# Altium schematic sheet contactor_control.SchDoc: foxBMS BMS-Master
size A3; DocumentNumber: 16; SheetNumber: 16; SheetTotal: 24; Author: Fraunhofer IISB foxBMS Team; REL-DATE: 2017-05-16; VERSION: 1.0.2; SheetDescription: Contactor Control
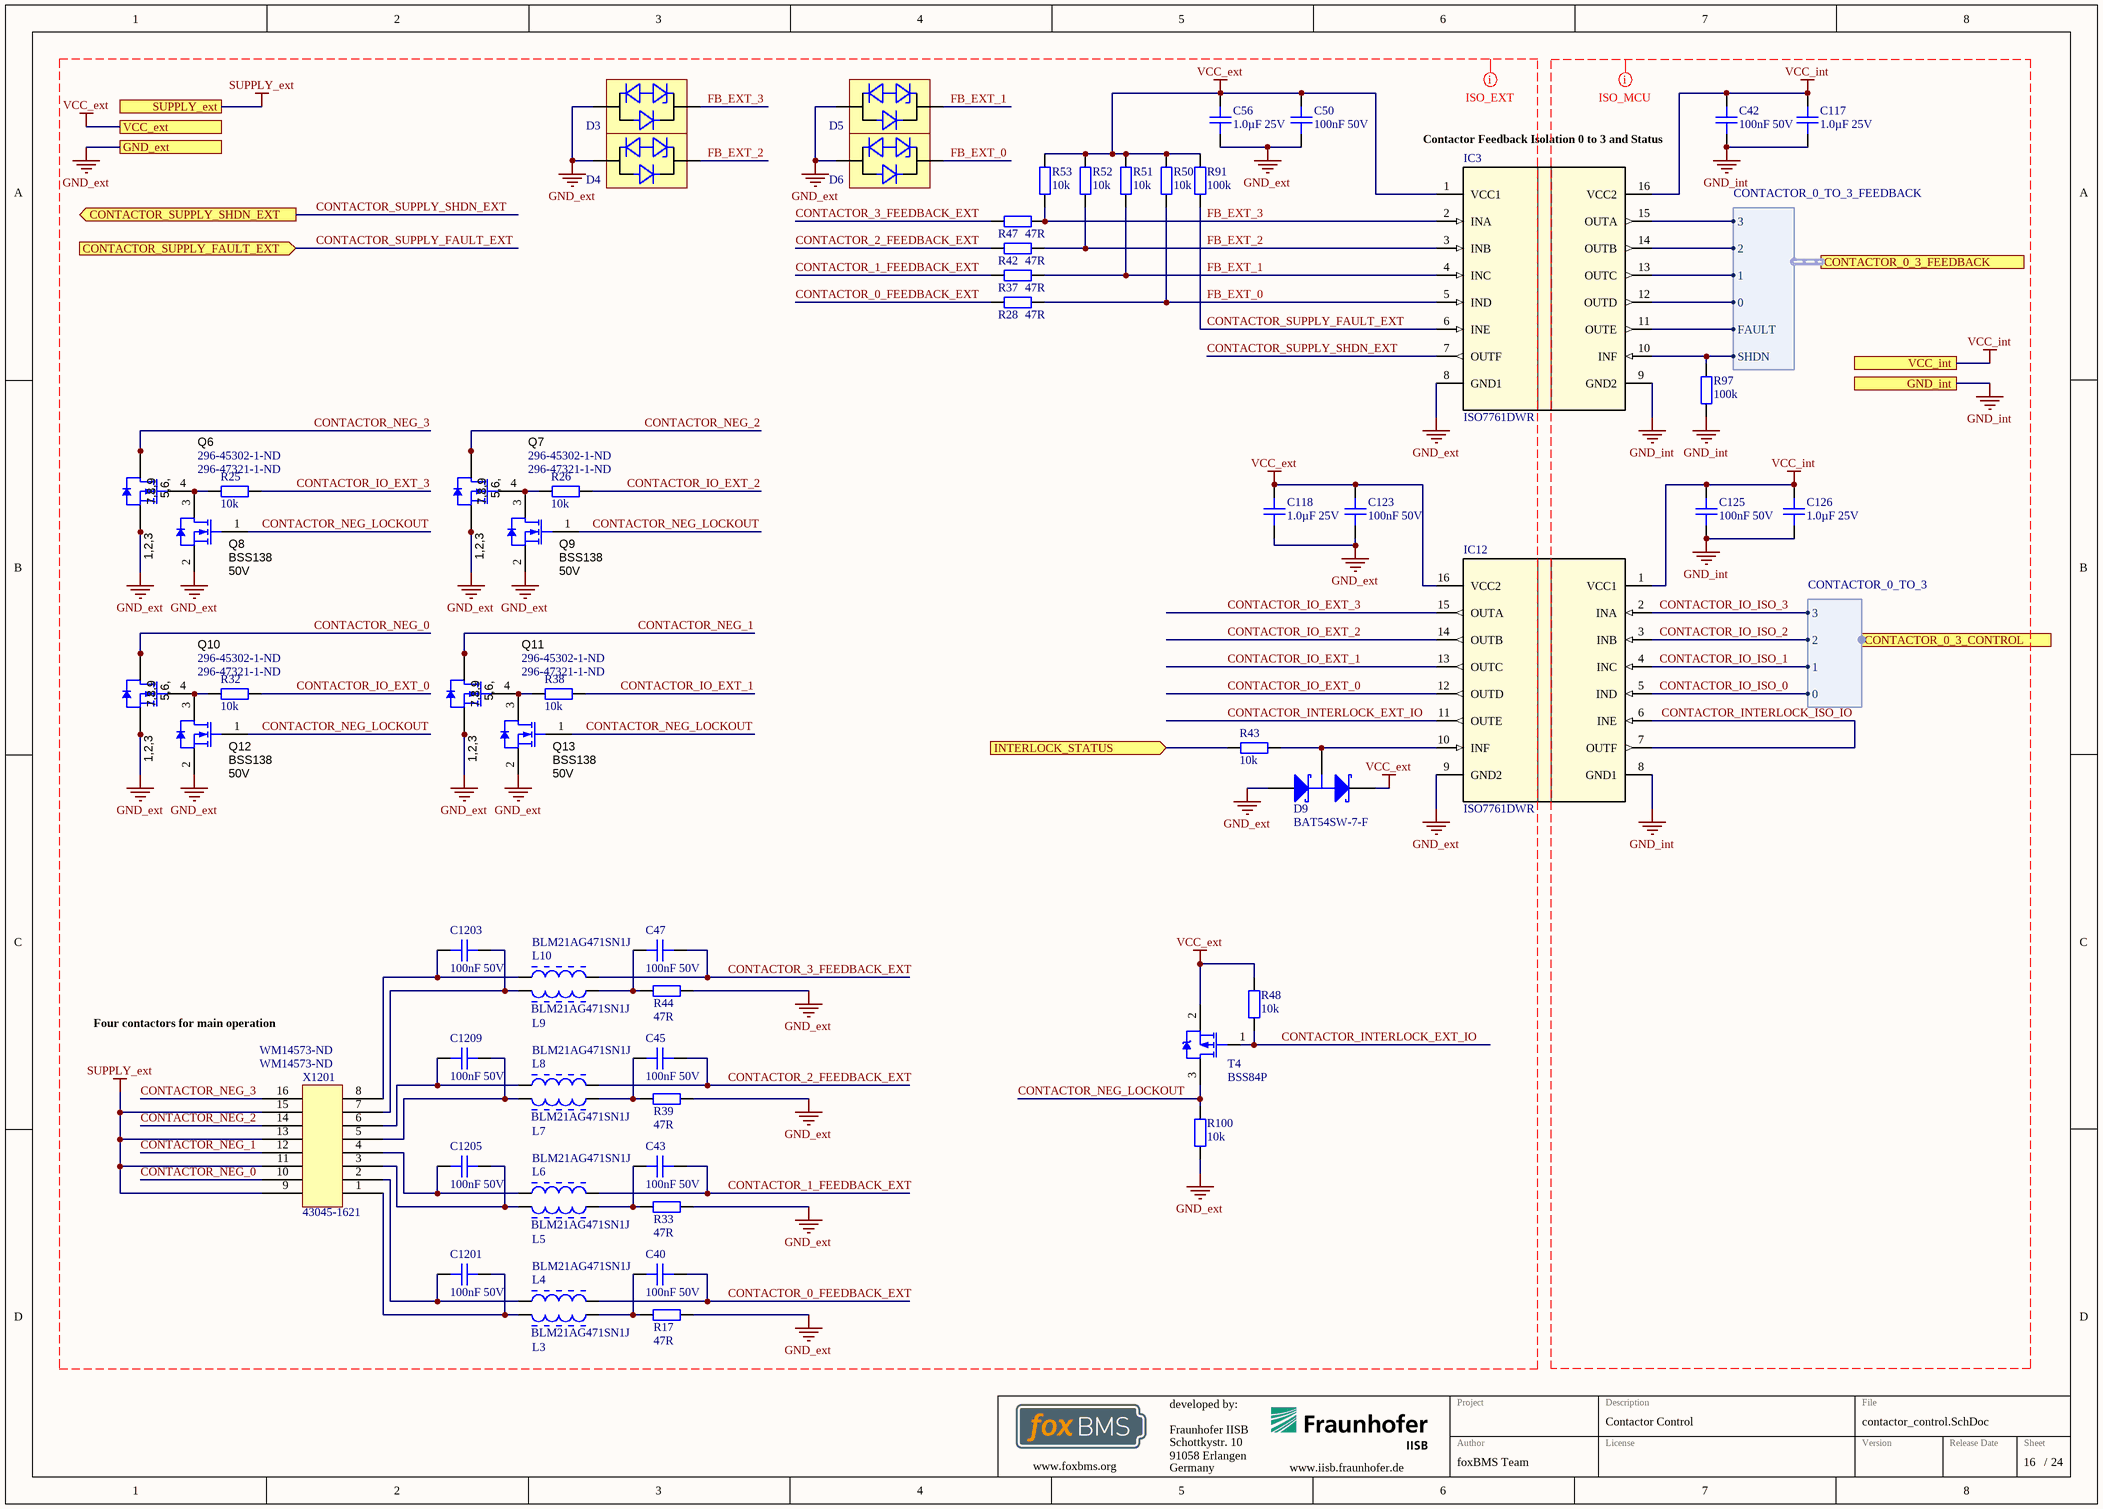
[diagram p0: contactor_control.SchDoc]

## Parts
C40  100nF 50V  [0603C]
C42  100nF 50V  [0603C]
C43  100nF 50V  [0603C]
C45  100nF 50V  [0603C]
C47  100nF 50V  [0603C]
C50  100nF 50V  [0603C]
C56  1.0µF 25V  [0603C]
C117  1.0µF 25V  [0603C]
C118  1.0µF 25V  [0603C]
C123  100nF 50V  [0603C]
C125  100nF 50V  [0603C]
C126  1.0µF 25V  [0603C]
C1201  100nF 50V  [0603C]
C1203  100nF 50V  [0603C]
C1205  100nF 50V  [0603C]
C1209  100nF 50V  [0603C]
D3  CDSOD323-T05  [SODFL250X110-2N]  (value not drawn)
D4  CDSOD323-T05  [SODFL250X110-2N]  (value not drawn)
D5  CDSOD323-T05  [SODFL250X110-2N]  (value not drawn)
D6  CDSOD323-T05  [SODFL250X110-2N]  (value not drawn)
D9  BAT54SW-7-F  [DIOD-SOT323-3_V]
IC3  ISO7761DWR  [DW0016B_N]
IC12  ISO7761DWR  [DW0016B_N]
L3  BLM21AG471SN1J  [MURA-BLM21-H1-CHIP-2_V]
L4  BLM21AG471SN1J  [MURA-BLM21-H1-CHIP-2_V]
L5  BLM21AG471SN1J  [MURA-BLM21-H1-CHIP-2_V]
L6  BLM21AG471SN1J  [MURA-BLM21-H1-CHIP-2_V]
L7  BLM21AG471SN1J  [MURA-BLM21-H1-CHIP-2_V]
L8  BLM21AG471SN1J  [MURA-BLM21-H1-CHIP-2_V]
L9  BLM21AG471SN1J  [MURA-BLM21-H1-CHIP-2_V]
L10  BLM21AG471SN1J  [MURA-BLM21-H1-CHIP-2_V]
Q6  Supplier Part Number 1: 296-45302-1-ND  Supplier Part Number 2: 296-47321-1-ND  [SONQ3A]  (hidden comment: CSD18543Q3A)
Q7  Supplier Part Number 1: 296-45302-1-ND  Supplier Part Number 2: 296-47321-1-ND  [SONQ3A]  (hidden comment: CSD18543Q3A)
Q8  BSS138  value 50V  [SOT-23]
Q9  BSS138  value 50V  [SOT-23]
Q10  Supplier Part Number 1: 296-45302-1-ND  Supplier Part Number 2: 296-47321-1-ND  [SONQ3A]  (hidden comment: CSD18543Q3A)
Q11  Supplier Part Number 1: 296-45302-1-ND  Supplier Part Number 2: 296-47321-1-ND  [SONQ3A]  (hidden comment: CSD18543Q3A)
Q12  BSS138  value 50V  [SOT-23]
Q13  BSS138  value 50V  [SOT-23]
R17  47R  [0603R]
R25  10k  [0603R]
R26  10k  [0603R]
R28  47R  [0603R]
R32  10k  [0603R]
R33  47R  [0603R]
R37  47R  [0603R]
R38  10k  [0603R]
R39  47R  [0603R]
R42  47R  [0603R]
R43  10k  [0603R]
R44  47R  [0603R]
R47  47R  [0603R]
R48  10k  [0603R]
R50  10k  [0603R]
R51  10k  [0603R]
R52  10k  [0603R]
R53  10k  [0603R]
R91  100k  [0603R]
R97  100k  [0603R]
R100  10k  [0603R]
T4  BSS84P  [INF-PG-SOT23_N]
X1201  43045-1621  Supplier Part Number 1: WM14573-ND  [43045-1621]

## Ports
CONTACTOR_0_3_CONTROL (harness CONTACTOR_0_TO_3), CONTACTOR_0_3_FEEDBACK (harness CONTACTOR_0_TO_3_FEEDBACK), CONTACTOR_SUPPLY_FAULT_EXT (in), CONTACTOR_SUPPLY_SHDN_EXT (out), GND_ext, GND_int, INTERLOCK_STATUS (in), SUPPLY_ext, VCC_ext, VCC_int

## Harnesses
CONTACTOR_0_TO_3: 0, 1, 2, 3
CONTACTOR_0_TO_3_FEEDBACK: 0, 1, 2, 3, FAULT, SHDN

## Nets
GND_ext: C50.2 C56.2 C118.2 C123.2 D3.2(A) D4.2(A) D5.2(A) D6.2(A) D9.1(A) IC3.8(GND1) IC12.9(GND2) Q6.1(S) Q6.2(S) Q6.3(S) Q7.1(S) Q7.2(S) Q7.3(S) Q8.2(S) Q9.2(S) Q10.1(S) Q10.2(S) Q10.3(S) Q11.1(S) Q11.2(S) Q11.3(S) Q12.2(S) Q13.2(S) R17.2 R33.2 R39.2 R44.2 R100.1 ; port GND_ext
GND_int: C42.2 C117.2 C125.2 C126.2 IC3.9(GND2) IC12.8(GND1) R97.1 ; port GND_int
SUPPLY_ext: X1201.9 X1201.11 X1201.13 X1201.15 ; port SUPPLY_ext
VCC_ext: C50.1 C56.1 C118.1 C123.1 D9.2(K) IC3.1(VCC1) IC12.16(VCC2) R48.2 R50.2 R51.2 R52.2 R53.2 R91.2 T4.2(SOURCE) ; port VCC_ext
VCC_int: C42.1 C117.1 C125.1 C126.1 IC3.16(VCC2) IC12.1(VCC1) ; port VCC_int
CONTACTOR_0_FEEDBACK_EXT: C40.2 L4.2 R28.1
CONTACTOR_1_FEEDBACK_EXT: C43.2 L6.2 R37.1
CONTACTOR_2_FEEDBACK_EXT: C45.2 L8.2 R42.1
CONTACTOR_3_FEEDBACK_EXT: C47.2 L10.2 R47.2
CONTACTOR_INTERLOCK_EXT_IO: IC12.11(OUTE) R48.1 T4.1(GATE)
CONTACTOR_INTERLOCK_ISO_IO: IC12.6(INE) IC12.7(OUTF)
CONTACTOR_IO_EXT_0: IC12.12(OUTD) R32.1
CONTACTOR_IO_EXT_1: IC12.13(OUTC) R38.1
CONTACTOR_IO_EXT_2: IC12.14(OUTB) R26.1
CONTACTOR_IO_EXT_3: IC12.15(OUTA) R25.1
CONTACTOR_IO_ISO_0: IC12.5(IND) ; port CONTACTOR_0_3_CONTROL.0
CONTACTOR_IO_ISO_1: IC12.4(INC) ; port CONTACTOR_0_3_CONTROL.1
CONTACTOR_IO_ISO_2: IC12.3(INB) ; port CONTACTOR_0_3_CONTROL.2
CONTACTOR_IO_ISO_3: IC12.2(INA) ; port CONTACTOR_0_3_CONTROL.3
CONTACTOR_NEG_0: Q10.5(D) Q10.6(D) Q10.7(D) Q10.8(D) Q10.9(D) X1201.10
CONTACTOR_NEG_1: Q11.5(D) Q11.6(D) Q11.7(D) Q11.8(D) Q11.9(D) X1201.12
CONTACTOR_NEG_2: Q7.5(D) Q7.6(D) Q7.7(D) Q7.8(D) Q7.9(D) X1201.14
CONTACTOR_NEG_3: Q6.5(D) Q6.6(D) Q6.7(D) Q6.8(D) Q6.9(D) X1201.16
CONTACTOR_NEG_LOCKOUT: Q8.1(G) Q9.1(G) Q12.1(G) Q13.1(G) R100.2 T4.3(DRAIN)
CONTACTOR_SUPPLY_FAULT_EXT: IC3.6(INE) R91.1 ; port CONTACTOR_SUPPLY_FAULT_EXT
CONTACTOR_SUPPLY_SHDN_EXT: IC3.7(OUTF) ; port CONTACTOR_SUPPLY_SHDN_EXT
FB_EXT_0: D6.1(K) IC3.5(IND) R28.2 R50.1
FB_EXT_1: D5.1(K) IC3.4(INC) R37.2 R51.1
FB_EXT_2: D4.1(K) IC3.3(INB) R42.2 R52.1
FB_EXT_3: D3.1(K) IC3.2(INA) R47.1 R53.1
INTERLOCK_STATUS: R43.2 ; port INTERLOCK_STATUS
NetC40_1: C40.1 L3.2 R17.1
NetC43_1: C43.1 L5.2 R33.1
NetC45_1: C45.1 L7.2 R39.1
NetC47_1: C47.1 L9.2 R44.1
NetC1201_1: C1201.1 L4.1 X1201.2
NetC1201_2: C1201.2 L3.1 X1201.1
NetC1203_1: C1203.1 L10.1 X1201.8
NetC1203_2: C1203.2 L9.1 X1201.7
NetC1205_1: C1205.1 L6.1 X1201.4
NetC1205_2: C1205.2 L5.1 X1201.3
NetC1209_1: C1209.1 L8.1 X1201.6
NetC1209_2: C1209.2 L7.1 X1201.5
NetD9_3: D9.3(C) IC12.10(INF) R43.1
NetIC3_10: IC3.10(INF) R97.2 ; port CONTACTOR_0_3_FEEDBACK.SHDN
NetIC3_11: IC3.11(OUTE) ; port CONTACTOR_0_3_FEEDBACK.FAULT
NetIC3_12: IC3.12(OUTD) ; port CONTACTOR_0_3_FEEDBACK.0
NetIC3_13: IC3.13(OUTC) ; port CONTACTOR_0_3_FEEDBACK.1
NetIC3_14: IC3.14(OUTB) ; port CONTACTOR_0_3_FEEDBACK.2
NetIC3_15: IC3.15(OUTA) ; port CONTACTOR_0_3_FEEDBACK.3
NetQ6_4: Q6.4(G) Q8.3(D) R25.2
NetQ7_4: Q7.4(G) Q9.3(D) R26.2
NetQ10_4: Q10.4(G) Q12.3(D) R32.2
NetQ11_4: Q11.4(G) Q13.3(D) R38.2

## Layout directives
net class ISO_MCU: CONTACTOR_INTERLOCK_ISO_IO, CONTACTOR_IO_ISO_0, CONTACTOR_IO_ISO_1, CONTACTOR_IO_ISO_2, CONTACTOR_IO_ISO_3, GND_int, VCC_int
net class ISO_EXT: CONTACTOR_0_FEEDBACK_EXT, CONTACTOR_1_FEEDBACK_EXT, CONTACTOR_2_FEEDBACK_EXT, CONTACTOR_3_FEEDBACK_EXT, CONTACTOR_INTERLOCK_EXT_IO, CONTACTOR_IO_EXT_0, CONTACTOR_IO_EXT_1, CONTACTOR_IO_EXT_2, CONTACTOR_IO_EXT_3, CONTACTOR_NEG_0, CONTACTOR_NEG_1, CONTACTOR_NEG_2, CONTACTOR_NEG_3, CONTACTOR_NEG_LOCKOUT, CONTACTOR_SUPPLY_FAULT_EXT, CONTACTOR_SUPPLY_SHDN_EXT, FB_EXT_0, FB_EXT_1, FB_EXT_2, FB_EXT_3, GND_ext, SUPPLY_ext, VCC_ext

## Notes on the sheet
- (near C42) Contactor Feedback Isolation 0 to 3 and Status
- Four contactors for main operation
- Fraunhofer IISB
- Schottkystr. 10
- developed by:
- 91058 Erlangen
- Germany
- Author
- Project
- License
- Description
- File
- Version
- Release Date
- Sheet
- www.foxbms.org
- www.iisb.fraunhofer.de
- foxBMS Team
- /
- (in symbol CSD18543Q3A) 7,8,9; 5,6,; 1,2,3

## Library data of the parts
C40 C42 C43 C45 C47 C50 C123 C125 C1201 C1203 C1205 C1209 = gen_C_ceramic_100n_50V_X7R_0603: Ceramic, 100nF, ±10%, 50V, X7R, –55 to 125°C, 0603 (1608),RoHS, Automotive; Part Number: GCJ188R71H104KA12; Manufacturer: Murata; Capacitance: 100n; Case EIA: 0603; Case Metric: 1608; PnP Package: C_0603_10; PnP Value: 100nF/50V/X7R; PnP equipped: x; Automotive Qualified: True; Rated Voltage: 50V; Dielectric: X7R; Supplier 1: Digi-Key; Supplier Part Number 1: 490-5798-1-ND; Height - Seated (Max): 0.8mm; Mounting Type: SurfaceMount,MLCC; Operating Temperature: –55 to 125°C; Series: GCJ; Tolerance: ±10%; Manufacturer_Part_Number: GCJ188R71H104KA12
C56 C117 C118 C126 = gen_C_ceramic_1u_25V_X7R_0603: Ceramic, 1.0µF, ±10%, 25V, X7R, –55 to 125°C, 0603 (1608),RoHS, Automotive; Part Number: GCJ188R71E105KA01; Manufacturer: Murata; Capacitance: 1µF; Case EIA: 0603; Case Metric: 1608; PnP Package: C_0603_10; PnP Value: 1.0µF/25V/X7R; Automotive Qualified: True; Rated Voltage: 25V; Dielectric: X7R; Supplier 1: Digi-Key; Supplier Part Number 1: 490-14409-1-ND; Height - Seated (Max): 0.8mm; Mounting Type: SurfaceMount,MLCC; Operating Temperature: –55 to 125°C; Series: GCJ; Tolerance: ±10%; Manufacturer_Part_Number: GCJ188R71E105KA01
D3-D6 = CDSOD323-T05: TVS Diode, CDSOD323 Series, Unidirectional, 5 V, 18.3 V, SOD-323, 2 Pins; Manufacturer: Bourns; Breakdown Voltage: 6V; Automotive Qualified: False; Part Number: CDSOD323-T05; Part Name: CDSOD323-T05; Operating Temperature: -55°C - +150°C; ComponentLink1Description: Datasheet; ComponentLink1URL: http://www.farnell.com/datasheets/1845299.pdf; Supplier 1: Farnell; Supplier Part Number 1: 2341914
D9 = CMP-2000-05929-1: Schottky Barrier Diode, 30 V, 200 mA, -65 to 125 degC, 3-Pin SOT323, RoHS, Tape and Reel; Unit Weight: 0.000212oz; Ifsm - Forward Surge Current: 0.6A; Vf - Forward Voltage: 1Vat0.1A; Brand: DiodesIncorporated; Pd - Power Dissipation: 200mW; Ir - Reverse Current: 2uAat25V; Type: SurfaceMountSchottkyBarrierDiodeArray; Vrrm - Repetitive Reverse Voltage: 30V; If - Forward Current: 0.2A; trr - Reverse Recovery time: 5ns; Configuration: DualSeries; Minimum Operating Temperature: -65C; Mounting Style: SMD/SMT; Manufacturer URL: http://www.diodes.com/; Mounting Technology: SurfaceMount; Packaging: Reel; Length: 2.2mm; Product Category: SchottkyDiodes&Rectifiers; Datasheet Version: Rev. 15-2, 03/2014; Series: BAT54; Operating Temperature Range: -65Cto+125C; Manufacturer: DiodesIncorporated; Technology: Si; Datasheet URL: http://www.diodes.com/_files/datasheets/ds30065.pdf; Height: 1mm; Width: 1.35mm; Termination Style: SMD/SMT; Maximum Operating Temperature: +125C; Product: SchottkyDiodes; Package / Case: SOT-323; Package Reference: SOT323; RoHS: True; Package Description: 3-Pin Small Outline Transistor, Body 2 x 1.25 mm, Pitch 0.65 mm; Factory Pack Quantity: 3000
IC3 IC12 = ISO7761DWR: Imported; Manufacturer: Texas Instruments; PartNumber: ISO7761DWR; RefDes: RefDes; TYPE: TYPE; Value: Value
L3-L10 = C5133952-28DE-41F1-874F-4A9C3E40D898: Chip Ferrite Bead for General Signal lines, 470 Ohm, 700 mA, -55 to 125 degC, 2 x 1.25 x 1.05 mm SMD, Tape and Reel; Manufacturer: Murata; DC Resistance: 0.19 Ohm Max.; Impedance (at 100 MHz): 470 Ohm +/- 25%; Rated Current: 700 mA; ComponentLink1URL: http://www.murata.com/; Packing: Tape and Reel; PackageDescription: 2-Pin Chip, Body 2 x 1.25 mm; ComponentLink3Description: Package Specification; Operating Temperature Range: -55 to 125 degC; ComponentLink1Description: Manufacturer URL; PartNumber: BLM21AG471SN1J; DatasheetVersion: 08/2013; Mounting Technology: Surface Mount; ComponentLink2URL: http://www.murata.com/products/catalog/pdf/c31e.pdf; ComponentLink3URL: http://www.murata.com/products/catalog/pdf/c31e.pdf; ComponentLink2Description: Datasheet; PackageReference: BLM21_H1050-2; Part Number: BLM21AG471SN1J
Q6 Q7 Q10 Q11 = CSD18543Q3A: 60V, N ch NexFET MOSFET™, single SON3x3, 9.9mOhm; Manufacturer: Texas Instruments; Alternate Manufacturer: None; CompType: MOSFET; Value: 30V; U/M: EA; VdsMax_V: 60; Value1: 0.0081 ohm; Rdson45_Ohm: 0.0081; Value2: 1.7 nC; QgTyp_nC: 1.7; Vgs_V: 10; IdsMax_A: 156; SymbolVersion: 2008-07-09; PartNumber: CSD18543Q3A; PackageReference: SON 3.3x3.3mm; ChType: N; RoHS: Y; MountType: SMT; Published: 2008-06-19; Publisher: Texas Instruments; LatestRevisionDate: 2013-07-24; LatestRevisionNote: Added parts.; ComponentLink1Description: Datasheet link; ComponentLink1URL: http://www.ti.com/lit/ds/symlink/csd18543q3a.pdf; Supplier 1: Digi-Key; Supplier 2: Digi-Key
Q8 Q9 Q12 Q13 = BSS138: MOSFET, N-CH, 50V, 0.22A, SOT-23; Manufacturer: Fairchild Semiconductor; Alternate Manufacturer: None; U/M: EA; ChType: N; VdsMax_V: 50; Value1: 6 ohm; Rdson45_Ohm: 6; Value2: 1.7 nC; QgTyp_nC: 1.7; Vgs_V: 20; IdsMax_A: 0.22; ComponentLink1URL: http://www.fairchildsemi.com/ds/BS/BSS138.pdf; SymbolVersion: 2008-07-28; PackageReference: SOT-23; PartNumber: BSS138; ComponentLink1Description: Datasheet link; CompType: MOSFET; RoHS: Y; MountType: SMT; Published: 2008-06-19; Publisher: Texas Instruments; LatestRevisionDate: 2013-07-10; LatestRevisionNote: Added parts.; Supplier 1: Digi-Key; Supplier Part Number 1: BSS138CT-ND; Supplier 2: Mouser; Supplier Part Number 2: 512-BSS138; Supplier 3: Farnell; Supplier Part Number 3: 9845330
R17 R28 R33 R37 R39 R42 R44 R47 = gen_R_47R_0603: SMD Resistor 47R 0603; Tolerance: 1%; Power: 0.1W; Case EIA: 0603; Case Metric: 1608; Maximum Working Voltage: 75V; PnP Package: R_0603; Automotive Qualified: False; Part Number: gen_R_47R_0603; Operating Temperature: -55°C - +155°C; Resistance: 47R; Series: E24; PnP Value: 47R; Supplier 1: Farnell; Supplier Part Number 1: 2303030
R25 R26 R32 R38 R43 R48 R50-R53 R100 = gen_R_10k_0603: SMD Resistor 10k 0603; Tolerance: 1%; Power: 0.1W; Case EIA: 0603; Case Metric: 1608; Maximum Working Voltage: 75V; PnP Package: R_0603; Automotive Qualified: False; Part Number: gen_R_10k_0603; Operating Temperature: -55°C - +155°C; Resistance: 10k; Series: E24, E96; PnP Value: 10k; Supplier 1: Farnell; Supplier Part Number 1: 2073349
R91 R97 = gen_R_100k_0603: SMD Resistor 100k 0603; Case EIA: 0603; Case Metric: 1608; PnP Package: R_0603; Automotive Qualified: False; Operating Temperature: -55°C - +155°C; PnP Value: 100k; Part Number: gen_R_100k_0603
T4 = CMP-1099-00028-1: P-Channel SIPMOS Small-Signal-Transistor, -60 V VDS, -0.17 A ID, -55 to 150 degC, PG-SOT23, Reel, Green; Manufacturer: Infineon; VGS(th) (max): -2Â V; VGS(th) (min): -1Â V; VDS (max): -60Â V; Rth: 350Â K/W; Pto t (max): 0.36Â W; ID (max): -0.17Â A; IDpuls (max): -0.68Â A; RDS (on) (max) (@4.5V): 12,000Â mOhm; QG: 1Â nC; Green: TRUE; RDS (on) (max): 8,000Â mOhm; ComponentLink3URL: http://www.infineon.com/dgdl/SOT23-Package_Overview.pdf?folderId=db3a30431936bc4b0119532290053c66&fileId=db3a30431936bc4b0119533468123c85; ComponentLink3Description: Package Specification; Packing: Reel; PartNumber: BSS84P; ComponentLink2Description: Datasheet; Mounting Technology: Surface Mount; ComponentLink2URL: http://www.infineon.com/dgdl/BSS84P_Rev2.7%5B1%5D.pdf?folderId=db3a304314dca38901154a72e3951a65&fileId=db3a304330f68606013118ac7a9b4549; PackageReference: PG-SOT23; ComponentLink1URL: http://www.infineon.com/; PackageVersion: Apr-08; ComponentLink1Description: Manufacturer URL; PackageDescription: 3-Pin Small Outline Transistor Package, 2.9 x 1.3 mm Body, 0.95 mm Pitch; Halogen-free: TRUE; DatasheetVersion: Rev. 2.7
X1201 = molex_microfit_3_08x2_THT: Micro-Fit 3.0 Right Angle Header, 3.00mm Pitch, Dual Row, 16 Circuits, with Snap-in Plastic Peg PCB Lock, Tin, Glow Wire Capable, Black, 43045-1600; Manufacturer: Molex; Circuits: 16; Rated Voltage: 600V; Rated Current: 8.5A; Automotive Qualified: False; Part Number: molex_microfit_3_08x2_THT; Part Name: MicroFit; Operating Temperature: -40°C - +105°C; Supplier 1: Digi-Key; Supplier 2: Digi-Key; Supplier Part Number 2: WM14573-ND